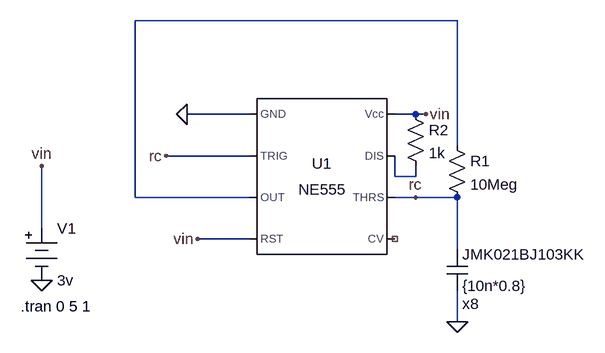
[diagram p0: schematic usmd.asc]
usmd.asc, the LTspice schematic file:
Version 4
SHEET 1 880 680
WIRE 432 -64 -64 -64
WIRE 112 80 16 80
WIRE 368 80 336 80
WIRE 384 80 368 80
WIRE 432 128 432 -64
WIRE 112 144 -16 144
WIRE 336 176 336 144
WIRE 368 176 368 160
WIRE 368 176 336 176
WIRE -64 208 -64 -64
WIRE 112 208 -64 208
WIRE 368 208 336 208
WIRE 432 208 368 208
WIRE -208 256 -208 160
WIRE 112 272 32 272
WIRE 432 288 432 208
WIRE 432 400 432 352
FLAG 432 400 0
FLAG -208 336 0
FLAG -208 160 vin
FLAG 32 272 vin
FLAG 384 80 vin
FLAG 16 80 0
FLAG 368 208 rc
FLAG -16 144 rc
SYMBOL Misc\\NE555 224 176 R0
SYMATTR InstName U1
SYMBOL cap 416 288 R0
WINDOW 123 24 84 Left 2
SYMATTR InstName JMK021BJ103KK
SYMATTR Value {10n*0.8}
SYMATTR Value2 x8
SYMBOL res 416 112 R0
SYMATTR InstName R1
SYMATTR Value 10Meg
SYMBOL Misc\\battery -208 240 R0
WINDOW 123 0 0 Left 2
WINDOW 39 0 0 Left 2
SYMATTR InstName V1
SYMATTR Value 3v
SYMBOL res 352 64 R0
SYMATTR InstName R2
SYMATTR Value 1k
TEXT -240 376 Left 2 !.tran 0 5 1

The netlist it stands for:
* usmd.asc
XU1 0 rc N001 vin NC_01 rc N002 vin NE555  ; pins GND TRIG OUT RST CV THRS DIS Vcc
C§JMK021BJ103KK rc 0 {10n*0.8} x8
R1 N001 rc 10Meg
V1 vin 0 3v
R2 vin N002 1k
.tran 0 5 1
.lib NE555.sub
.backanno
.end